# Altium project Diploma.PrjPcb
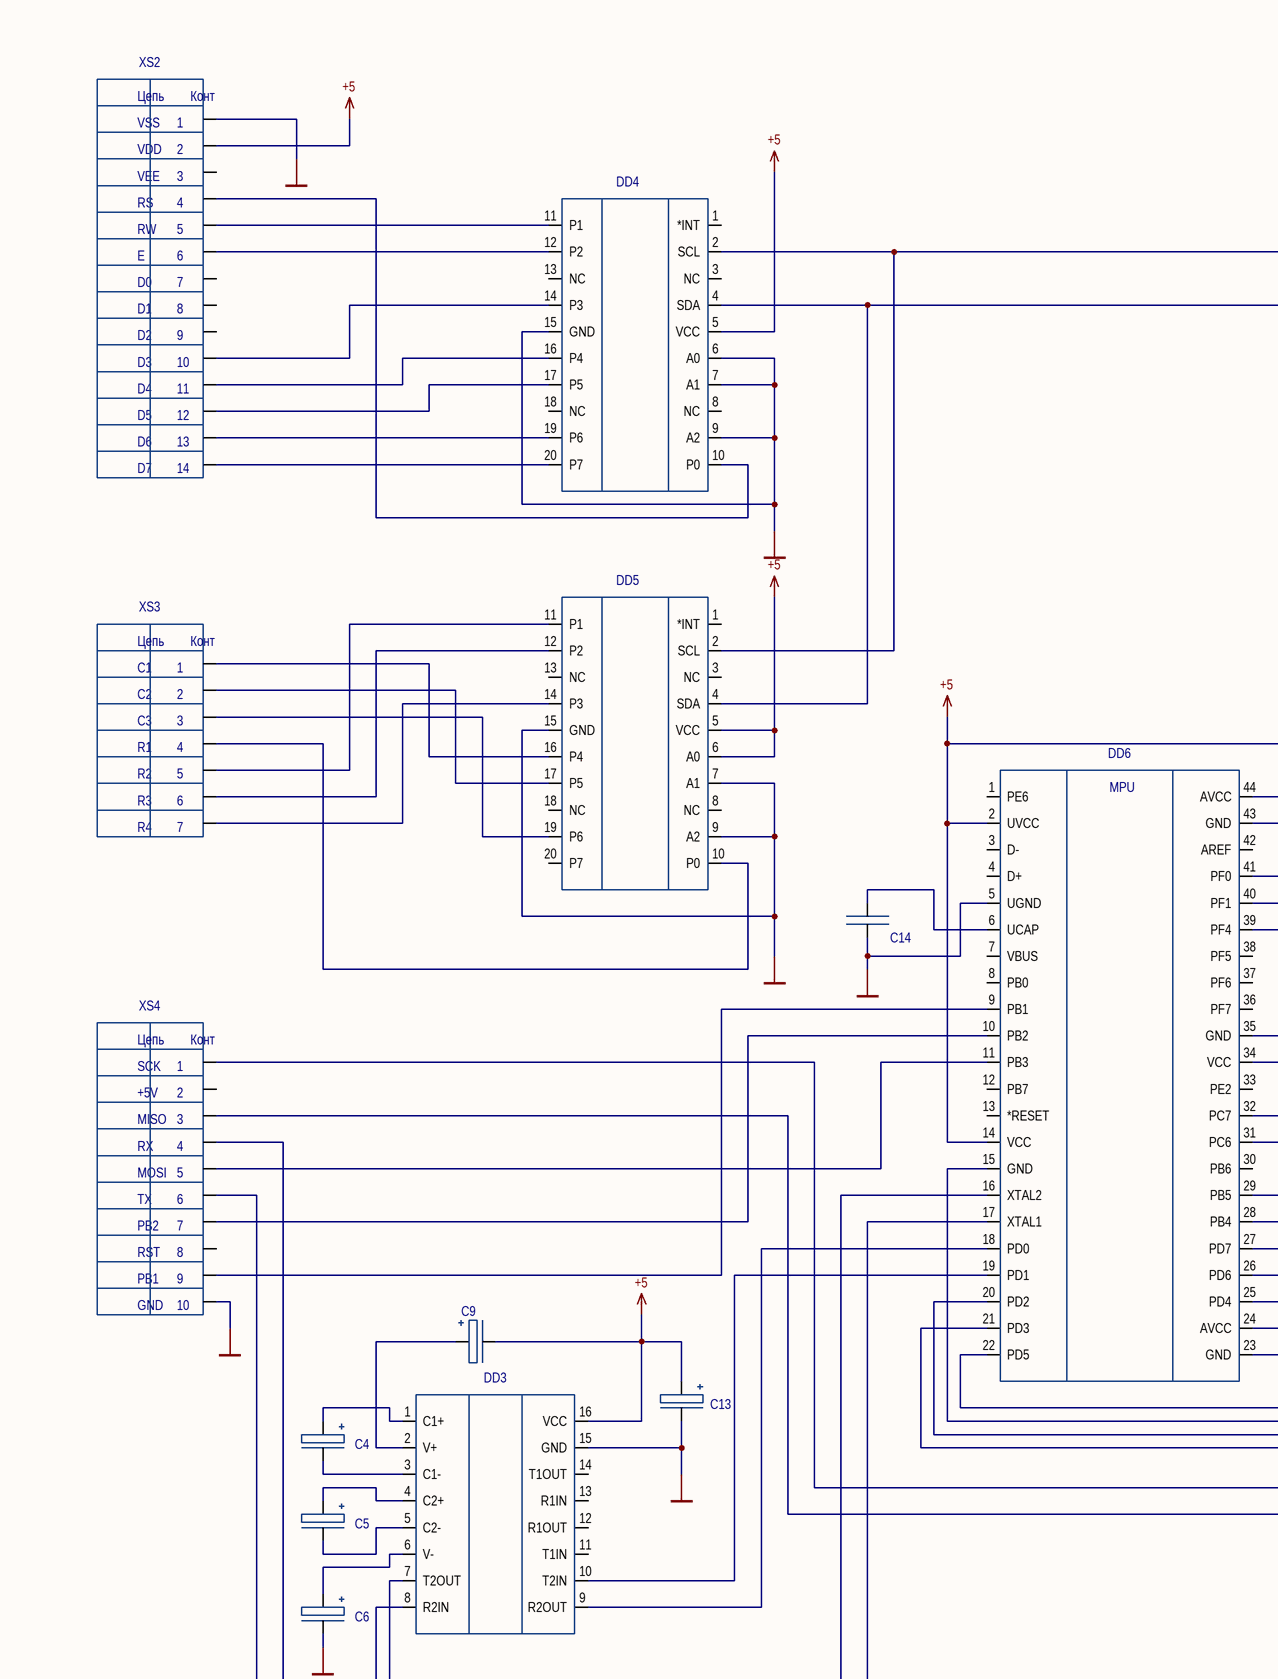
[diagram p0: main.SchDoc, top left]
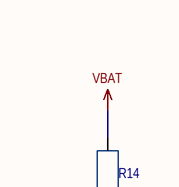
[diagram p1: main.SchDoc, top right]
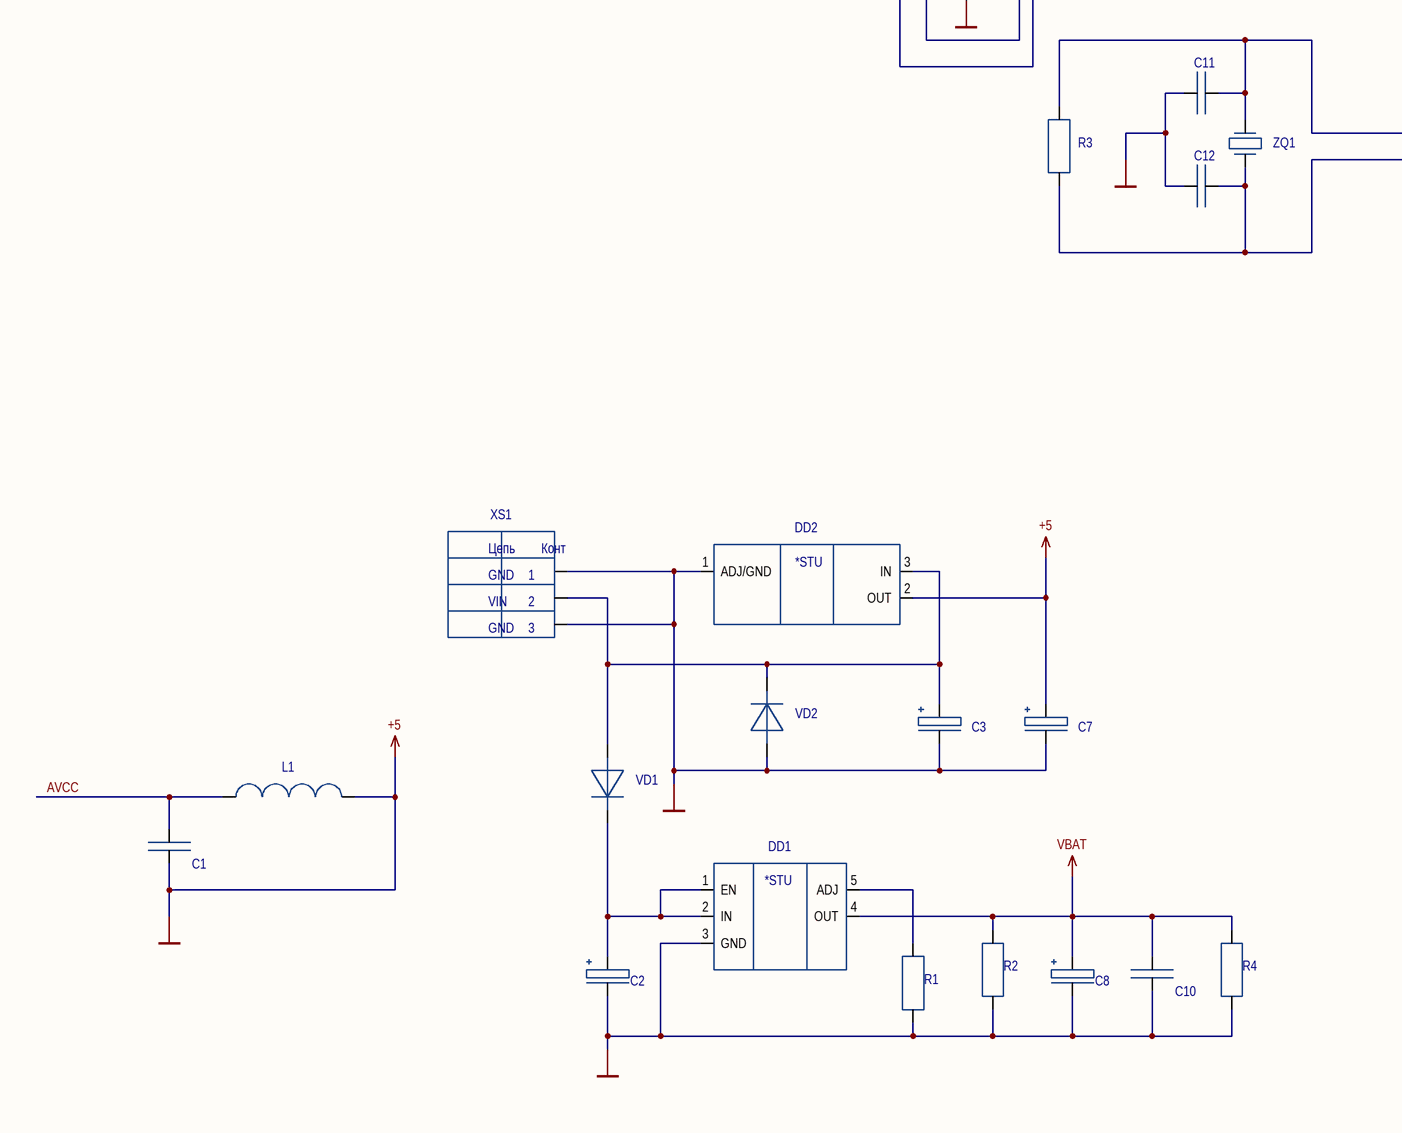
[diagram p2: main.SchDoc, bottom left]
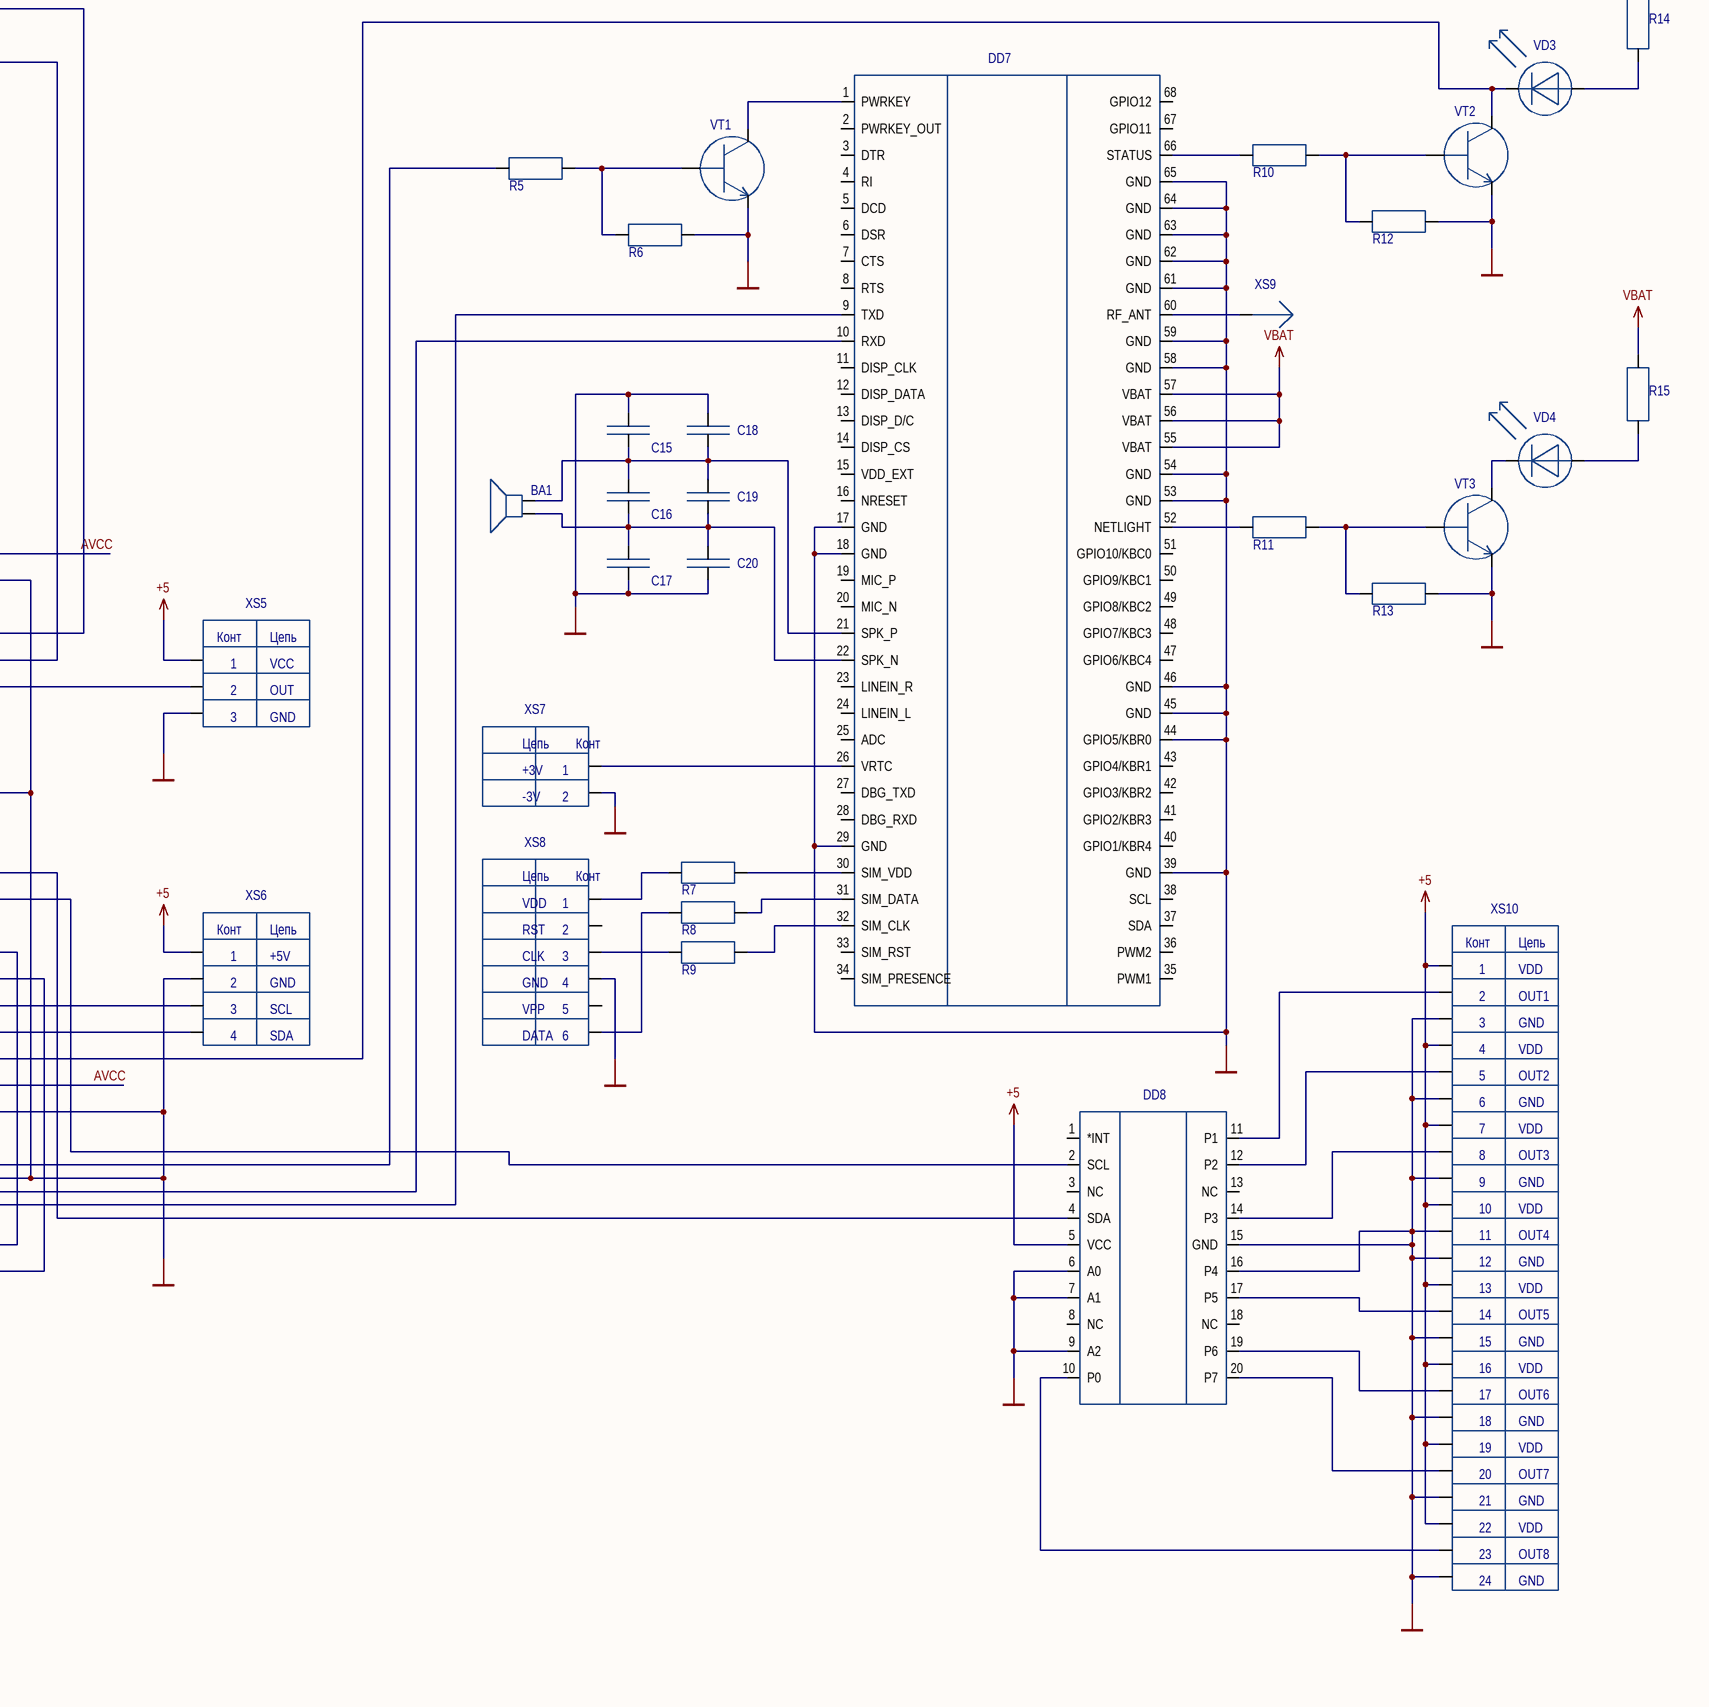
[diagram p3: main.SchDoc, bottom right]
3 sheets, 174 parts. Net scope: global (net labels, ports and power ports of the same name join across sheets).
Sheets:
  main.SchDoc
  struct.SchDoc
  SHEMPEL.SchDoc

## Sheet main.SchDoc
size 840 x 594 mm; CheckedBy: Смирнова; Author: Соколов; DrawnBy: Соколов; Organization: БГУИР, 750701; DocumentNumber: ГУИР.123456.001 Э3; SheetNumber: 1; SheetTotal: 1; Title1str: Дистанционная система; Title2str: управления климатом дома

### Parts
BA1  beeper_HPA17F  (value not drawn)
C1  cap_1mkF  (value not drawn)
C2  cap_pol_100mkF  (value not drawn)
C3  pol_10mkF  (value not drawn)
C4  pol_1mkF  (value not drawn)
C5  pol_1mkF  (value not drawn)
C6  pol_1mkF  (value not drawn)
C7  pol_10mkF  (value not drawn)
C8  cap_pol_100mkF  (value not drawn)
C9  pol_1mkF  (value not drawn)
C10  cap_100nF  (value not drawn)
C11  33pF  (value not drawn)
C12  33pF  (value not drawn)
C13  pol_1mkF  (value not drawn)
C14  cap_1mkF  (value not drawn)
C15  cap_10pF  (value not drawn)
C16  cap_10pF  (value not drawn)
C17  cap_10pF  (value not drawn)
C18  cap_33pF  (value not drawn)
C19  cap_33pF  (value not drawn)
C20  cap_33pF  (value not drawn)
DD1  stu_MIC29302WT  (value not drawn)
DD2  NCP1117ST50T3G  [SOT223-3_ONS]  (value not drawn)
DD3  MAX232CSE+  [21-0041_S16+3_MXM]  (value not drawn)
DD4  PCF8574DGVR  [DGV20]  (value not drawn)
DD5  PCF8574DGVR  [DGV20]  (value not drawn)
DD6  ATMEGA32U4RC-AU  [44ML_ATM]  (value not drawn)
DD7  SIM900A  (value not drawn)
DD8  PCF8574DGVR  [DGV20]  (value not drawn)
L1  inductor_10uH  (value not drawn)
R1  res_47k  (value not drawn)
R2  res_100K  (value not drawn)
R3  res_1M  (value not drawn)
R4  res_510  (value not drawn)
R5  res_4.7k  (value not drawn)
R6  res_47k  (value not drawn)
R7  res_22  (value not drawn)
R8  res_22  (value not drawn)
R9  res_22  (value not drawn)
R10  res_4.7k  (value not drawn)
R11  res_4.7k  (value not drawn)
R12  res_47k  (value not drawn)
R13  res_47k  (value not drawn)
R14  res_510  (value not drawn)
R15  res_510  (value not drawn)
VD1  diode_M7  (value not drawn)
VD2  diode_M7  (value not drawn)
VD3  diode_red  (value not drawn)
VD4  diode_red  (value not drawn)
VT1  BC547  (value not drawn)
VT2  BC547  (value not drawn)
VT3  BC547  (value not drawn)
XS1  power_supply_jack  (value not drawn)
XS2  LCD_connector  (value not drawn)
XS3  conn_Keypad  (value not drawn)
XS4  BH-10  (value not drawn)
XS5  VS1833B  (value not drawn)
XS6  usb_typeA  (value not drawn)
XS7  conn_Battery_CR2032  (value not drawn)
XS8  SIM5051-6-0-18-00-A  [SIM5051-6-0-18-00-A_GCT]  (value not drawn)
XS9  antenn_connector  (value not drawn)
XS10  ds1013  (value not drawn)
ZQ1  crystal_8mhz  (value not drawn)

### Nets
+5: C1.1 C2.1 C3.1 C6.1 C7.1 C7.2 C8.1 C9.1 C10.1 C11.2 C12.2 C13.1 C13.2 C15.2 C17.1 C18.2 C20.1 DD1.3(GND) DD2.1(ADJ/GND) DD2.2(OUT) DD3.15(GND) DD3.16(VCC) DD4.5(VCC) DD4.6(A0) DD4.7(A1) DD4.9(A2) DD4.15(GND) DD5.5(VCC) DD5.6(A0) DD5.7(A1) DD5.9(A2) DD5.15(GND) DD6.2(UVCC) DD6.14(VCC) DD6.15(GND) DD6.23(GND) DD6.34(VCC) DD6.35(GND) DD6.43(GND) DD7.17(GND) DD7.18(GND) DD7.29(GND) DD7.39(GND) DD7.44(GPIO5/KBR0) DD7.45(GND) DD7.46(GND) DD7.53(GND) DD7.54(GND) DD7.58(GND) DD7.59(GND) DD7.61(GND) DD7.62(GND) DD7.63(GND) DD7.64(GND) DD7.65(GND) DD8.5(VCC) DD8.6(A0) DD8.7(A1) DD8.9(A2) DD8.15(GND) DD8.16(P4) L1.2 R1.1 R2.1 R4.1 R6.2 R12.2 R13.2 VD2.1 VT1.1(E) VT2.1(E) VT3.1(E) XS1.1(+5V) XS1.3(SCL) XS2.1(VSS) XS2.2(VDD) XS4.10(D3) XS5.1(VCC) XS5.3(GND) XS6.1(+5V) XS6.2(GND) XS7.2 XS8.4(GND) XS10.1(VSS) XS10.3(VO) XS10.4(C/D) XS10.6(*WR) XS10.7(D0) XS10.9(D2) XS10.10(D3) XS10.11(D4) XS10.12(D5) XS10.13(D6) XS10.15 XS10.16 XS10.18 XS10.19 XS10.21 XS10.22 XS10.24  [also labelled GND]  [project net Y]
UGND: C14.1 DD6.5(UGND)
VBAT: C8.2 C10.2 DD1.4(OUT) DD7.55(VBAT) DD7.56(VBAT) DD7.57(VBAT) R2.2 R4.2 R14.2 R15.2
AVCC: C1.2 DD6.24(AVCC) DD6.44(AVCC) L1.1
NetBA1_1: BA1.1 C15.1 C16.2 C18.1 C19.2 DD7.21(SPK_P)
NetBA1_2: BA1.2 C16.1 C17.2 C19.1 C20.2 DD7.22(SPK_N)
NetC2_2: C2.2 DD1.1(EN) DD1.2(IN) VD1.2
NetC3_2: C3.2 DD2.3(IN) VD1.1 VD2.2 XS1.2(GND)
NetC4_1: C4.1 DD3.3(C1-)
NetC4_2: C4.2 DD3.1(C1+)
NetC5_1: C5.1 DD3.5(C2-)
NetC5_2: C5.2 DD3.4(C2+)
NetC6_2: C6.2 DD3.6(V-)
NetC9_2: C9.2 DD3.2(V+)
NetC11_1: C11.1 DD6.16(XTAL2) R3.2 ZQ1.2
NetC12_1: C12.1 DD6.17(XTAL1) R3.1 ZQ1.1
NetC14_2: C14.2 DD6.6(UCAP)
NetDD1_5: DD1.5(ADJ) R1.2
NetDD3_7: DD3.7(T2OUT) XS4.6(*WR)
NetDD3_8: DD3.8(R2IN) XS4.4(C/D)
NetDD3_9: DD3.9(R2OUT) DD6.18(PD0)
NetDD3_10: DD3.10(T2IN) DD6.19(PD1)
NetDD4_2: DD4.2(SCL) DD5.2(SCL) DD6.41(PF0)
NetDD4_4: DD4.4(SDA) DD5.4(SDA) DD6.40(PF1)
NetDD4_10: DD4.10(P0) XS2.4(C/D)
NetDD4_11: DD4.11(P1) XS2.5(*RD)
NetDD4_12: DD4.12(P2) XS2.6(*WR)
NetDD4_14: DD4.14(P3) XS2.10(D3)
NetDD4_16: DD4.16(P4) XS2.11(D4)
NetDD4_17: DD4.17(P5) XS2.12(D5)
NetDD4_19: DD4.19(P6) XS2.13(D6)
NetDD4_20: DD4.20(P7) XS2.14(D7)
NetDD5_10: DD5.10(P0) XS3.4(C/D)
NetDD5_11: DD5.11(P1) XS3.5(*RD)
NetDD5_12: DD5.12(P2) XS3.6(*WR)
NetDD5_14: DD5.14(P3) XS3.7(D0)
NetDD5_16: DD5.16(P4) XS3.1(VSS)
NetDD5_17: DD5.17(P5) XS3.2(VDD)
NetDD5_19: DD5.19(P6) XS3.3(VO)
NetDD6_9: DD6.9(PB1) XS4.9(D2)
NetDD6_10: DD6.10(PB2) XS4.7(D0)
NetDD6_11: DD6.11(PB3) XS4.5(*RD)
NetDD6_20: DD6.20(PD2) DD7.10(RXD)
NetDD6_21: DD6.21(PD3) DD7.9(TXD)
NetDD6_22: DD6.22(PD5) R5.1
NetDD6_25: DD6.25(PD4) VD3.2 VT2.3(C)
NetDD6_26: DD6.26(PD6) XS6.4(SDA)
NetDD6_27: DD6.27(PD7) XS6.3(SCL)
NetDD6_28: DD6.28(PB4) XS4.3(VO)
NetDD6_29: DD6.29(PB5) XS4.1(VSS)
NetDD6_31: DD6.31(PC6) DD8.2(SCL)
NetDD6_32: DD6.32(PC7) DD8.4(SDA)
NetDD6_39: DD6.39(PF4) XS5.2(OUT)
NetDD7_1: DD7.1(PWRKEY) VT1.3(C)
NetDD7_26: DD7.26(VRTC) XS7.1(VCC)
NetDD7_30: DD7.30(SIM_VDD) R7.2
NetDD7_31: DD7.31(SIM_DATA) R8.2
NetDD7_32: DD7.32(SIM_CLK) R9.2
NetDD7_52: DD7.52(NETLIGHT) R11.1
NetDD7_60: DD7.60(RF_ANT) XS9.1
NetDD7_66: DD7.66(STATUS) R10.1
NetDD8_10: DD8.10(P0) XS10.23
NetDD8_11: DD8.11(P1) XS10.2(VDD)
NetDD8_12: DD8.12(P2) XS10.5(*RD)
NetDD8_14: DD8.14(P3) XS10.8(D1)
NetDD8_17: DD8.17(P5) XS10.14(D7)
NetDD8_19: DD8.19(P6) XS10.17
NetDD8_20: DD8.20(P7) XS10.20
NetR5_2: R5.2 R6.1 VT1.2(B)
NetR7_1: R7.1 XS8.1(VCC)
NetR8_1: R8.1 XS8.6(I/O)
NetR9_1: R9.1 XS8.3(CLK)
NetR10_2: R10.2 R12.1 VT2.2(B)
NetR11_2: R11.2 R13.1 VT3.2(B)
NetR14_1: R14.1 VD3.1
NetR15_1: R15.1 VD4.1
NetVD4_2: VD4.2 VT3.3(C)

Not connected (* = marked no-connect by the designer): DD3 11(T1IN) 12(R1OUT) 13(R1IN) 14(T1OUT); DD4 1(*INT) 3(NC) 8(NC) 13(NC) 18(NC); DD5 1(*INT) 3(NC) 8(NC) 13(NC) 18(NC) 20(P7); DD6 1(PE6) 3(D-) 4(D+) 7(VBUS) 8(PB0) 12(PB7) 13(*RESET) 30(PB6) 33(PE2) 36(PF7) 37(PF6) 38(PF5) 42(AREF); DD7 2(PWRKEY_OUT) 3(DTR) 4(RI) 5(DCD) 6(DSR) 7(CTS) 8(RTS) 11(DISP_CLK) 12(DISP_DATA) 13(DISP_D/C) 14(DISP_CS) 15(VDD_EXT) 16(NRESET) 19(MIC_P) 20(MIC_N) 23(LINEIN_R) 24(LINEIN_L) 25(ADC) 27(DBG_TXD) 28(DBG_RXD) 33(SIM_RST) 34(SIM_PRESENCE) 35(PWM1) 36(PWM2) 37(SDA) 38(SCL) 40(GPIO1/KBR4) 41(GPIO2/KBR3) 42(GPIO3/KBR2) 43(GPIO4/KBR1) 47(GPIO6/KBC4) 48(GPIO7/KBC3) 49(GPIO8/KBC2) 50(GPIO9/KBC1) 51(GPIO10/KBC0) 67(GPIO11) 68(GPIO12); DD8 1(*INT) 3(NC) 8(NC) 13(NC) 18(NC); XS2 3(VO) 7(D0) 8(D1) 9(D2); XS4 2(VDD) 8(D1); XS8 2(RST) 5(VPP)

### Notes on the sheet
- Перв. примен.
- Справ. №
- Н.контр.
- Подп. и дата
- Инв. № дубл.
- Разраб.
- Взам. инв. №
- Изм.
- Лист
- № докум.
- Подп.
- Дата
- Лит.
- Масса
- Масштаб
- Пров.
- Т.контр.
- Листов
- Инв. № подл.
- Утв.
- Согласов.
- Копировал
- Формат  A1М
- (in symbol ATMEGA32U4RC-AU) MPU
- (in symbol conn_Battery_CR2032) Цепь; Конт; +3V; -3V
- (in symbol conn_Keypad) Цепь; Конт; C1; C2; C3; R1; R2; R3; R4
- (in symbol LCD_connector) Цепь; Конт; VEE; RS; RW; E
- (in symbol NCP1117ST50T3G) *STU
- (in symbol power_supply_jack) Цепь; Конт; VIN
- (in symbol RS-232) Цепь; Конт; SCK; +5V; MISO; RX; MOSI; TX; PB2; RST; PB1; GND
- (in symbol SIM5051-6-0-18-00-A) Цепь; Конт; VDD; DATA
- (in symbol stu_MIC29302WT) *STU
- (in symbol temperature_sensors_connector) Конт; Цепь; OUT1; GND; OUT2; OUT3; OUT4; OUT5; OUT6; OUT7; OUT8
- (in symbol usb_typeA) Конт; Цепь
- (in symbol VS1833B) Конт; Цепь

### Library data of the parts
C3 C7 = cap_pol_10mkF
C4-C6 C9 C13 = cap_pol_1mkF
C11 C12 = cap_33pF
DD2 = NCP1117ST50T3G: No Description Available; Vendor: ON Semiconductor; SourceLibrary: ONSemi_2017-12-12_4; Manufacturer_Part_Number: NCP1117ST50T3G; Copyright: Copyright (C) 2016 Accelerated Designs. All rights reserved; RefDes: RefDes; Type: DEV
DD3 = MAX232CSE+: No Description Available; SourceLibrary: Update_to_database_2021-01-29; Built_By: EMA_UL_Team; Vendor: Maxim Integrated Products; Revision: 4; Manufacturer_Part_Number: MAX232CSE+; Copyright: Copyright (C) 2018 Accelerated Designs. All rights reserved; RefDes: RefDes; Type: DEV
DD4 DD5 DD8 = PCF8574DGVR: Remote 8-Bit I/O Expander for I2C-Bus; Manufacturer: Texas Instruments; INDUSTRY_STD_PKG_TYPE: TVSOP; FAMILY_NAME: I2C IO EXPANDER; PIN_COUNT: 20; PACKAGE_DESIGNATOR: DGV; Datasheet_URL: http://www.ti.com/lit/gpn/PCF8574; GENERIC_PART_NUMBER: PCF8574; Vendor: Texas Instruments; Manufacturer_Part_Number: PCF8574DGVR; Copyright: Copyright (C) 2018 Accelerated Designs. All rights reserved; RefDes: RefDes; Type: DEV
DD6 = ATMEGA32U4RC-AU: No Description Available; Vendor: Atmel; Built_By: EMA_UL_Team; SourceLibrary: Atmel_2015-02-13; Manufacturer_Part_Number: ATMEGA32U4RC-AU; Copyright: Copyright (C) 2018 Accelerated Designs. All rights reserved; RefDes: RefDes; Type: DEV
XS4 = RS-232
XS8 = SIM5051-6-0-18-00-A: No Description Available; Vendor: Global Connector Technology; Built_By: EMA_Cory; SourceLibrary: GCT_2020-07-23; Datasheet: https://gct.co/files/drawings/sim5051.pdf; Manufacturer_Part_Number: SIM5051-6-0-18-00-A; Copyright: Copyright (C) 2018 Accelerated Designs. All rights reserved; RefDes: RefDes; Type: DEV
XS10 = temperature_sensors_connector

## Sheet struct.SchDoc
size 594 x 420 mm; CompanyName: БГУИР, 750701; SheetNumber: 2; SheetTotal: 2; Разраб.: Шемпель; Пров.: Смирнова
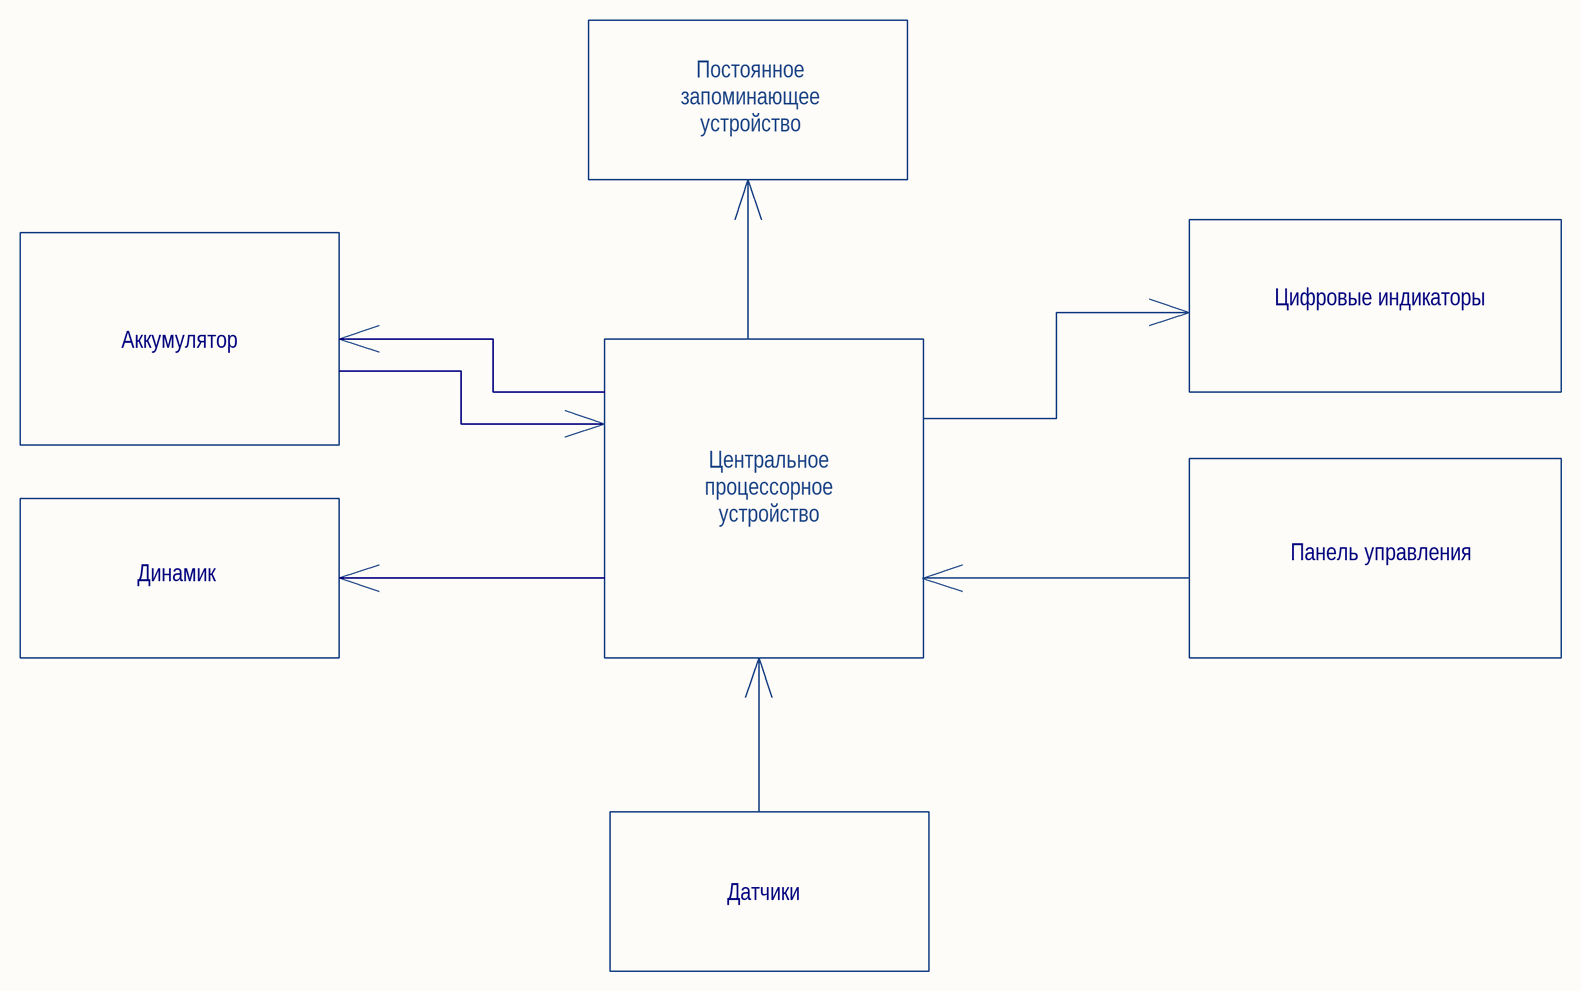
[diagram p4: struct.SchDoc]

### Notes on the sheet
- Постоянное запоминающее устройство
- Аккумулятор
- Цифровые индикаторы
- Центральное процессорное устройство
- Панель управления
- Динамик
- Датчики
- Перв. примен.
- Справ. №
- Подп. и дата
- Инв. № дубл.
- Взам. инв. №
- Разраб.
- Изм.
- Лист
- № докум.
- Подп.
- Дата
- Лит.
- Масса
- Масштаб
- Пров.
- Т.контр.
- Листов
- Инв. № подл.
- Утв.
- Н.контр.
- Копировал
- Формат А2

## Sheet SHEMPEL.SchDoc
size 840 x 594 mm; ListNumber: 1
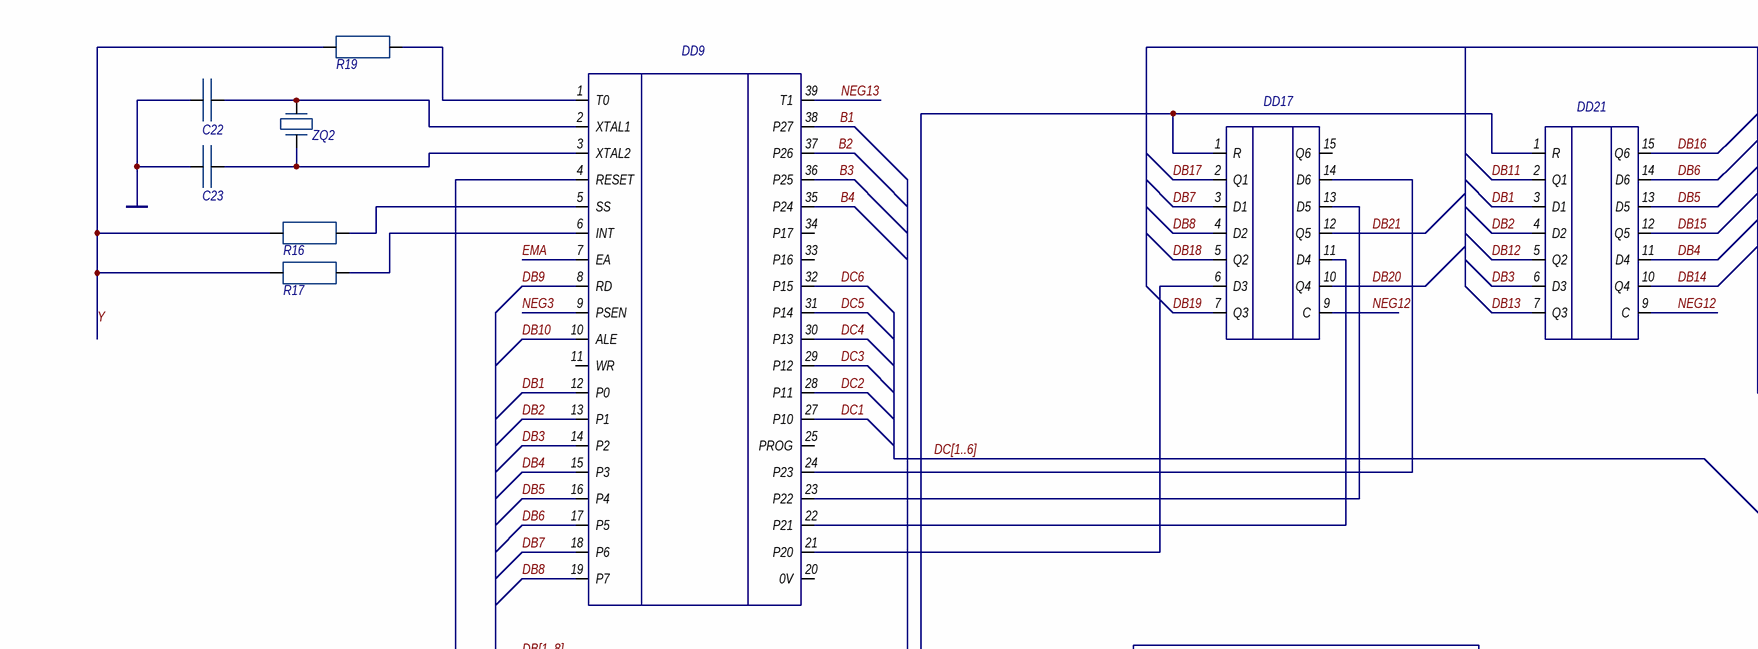
[diagram p5: SHEMPEL.SchDoc, top left]
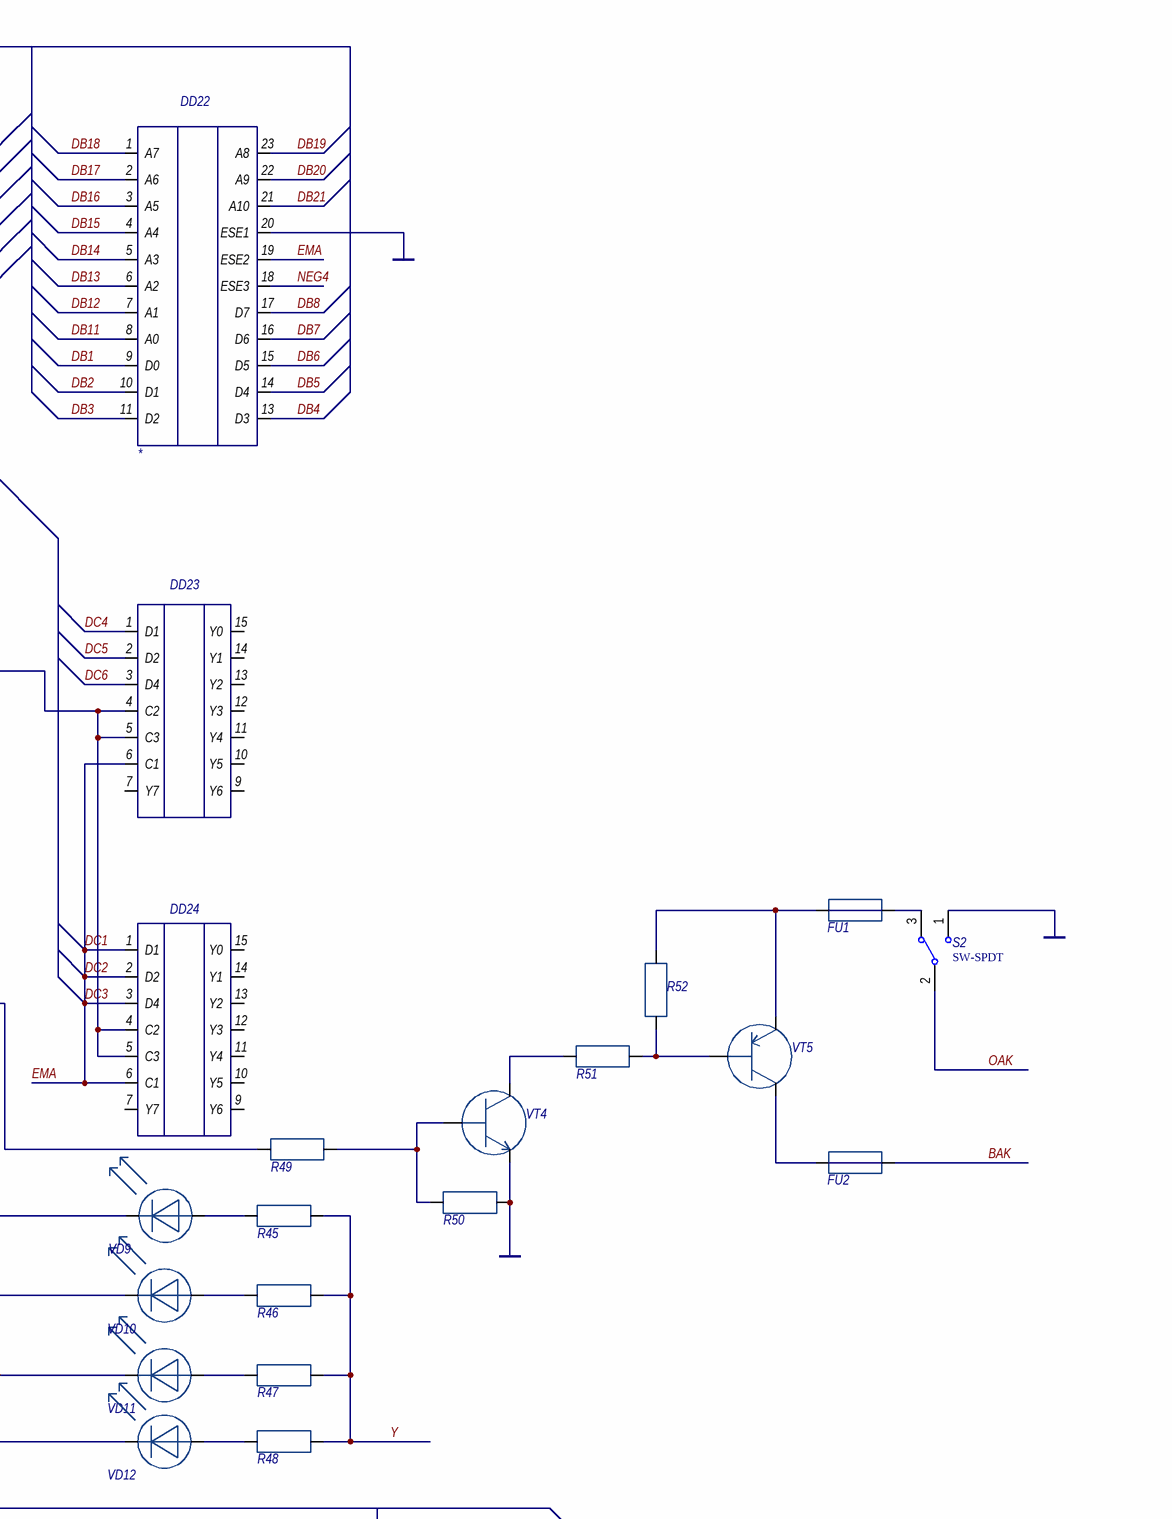
[diagram p6: SHEMPEL.SchDoc, top right]
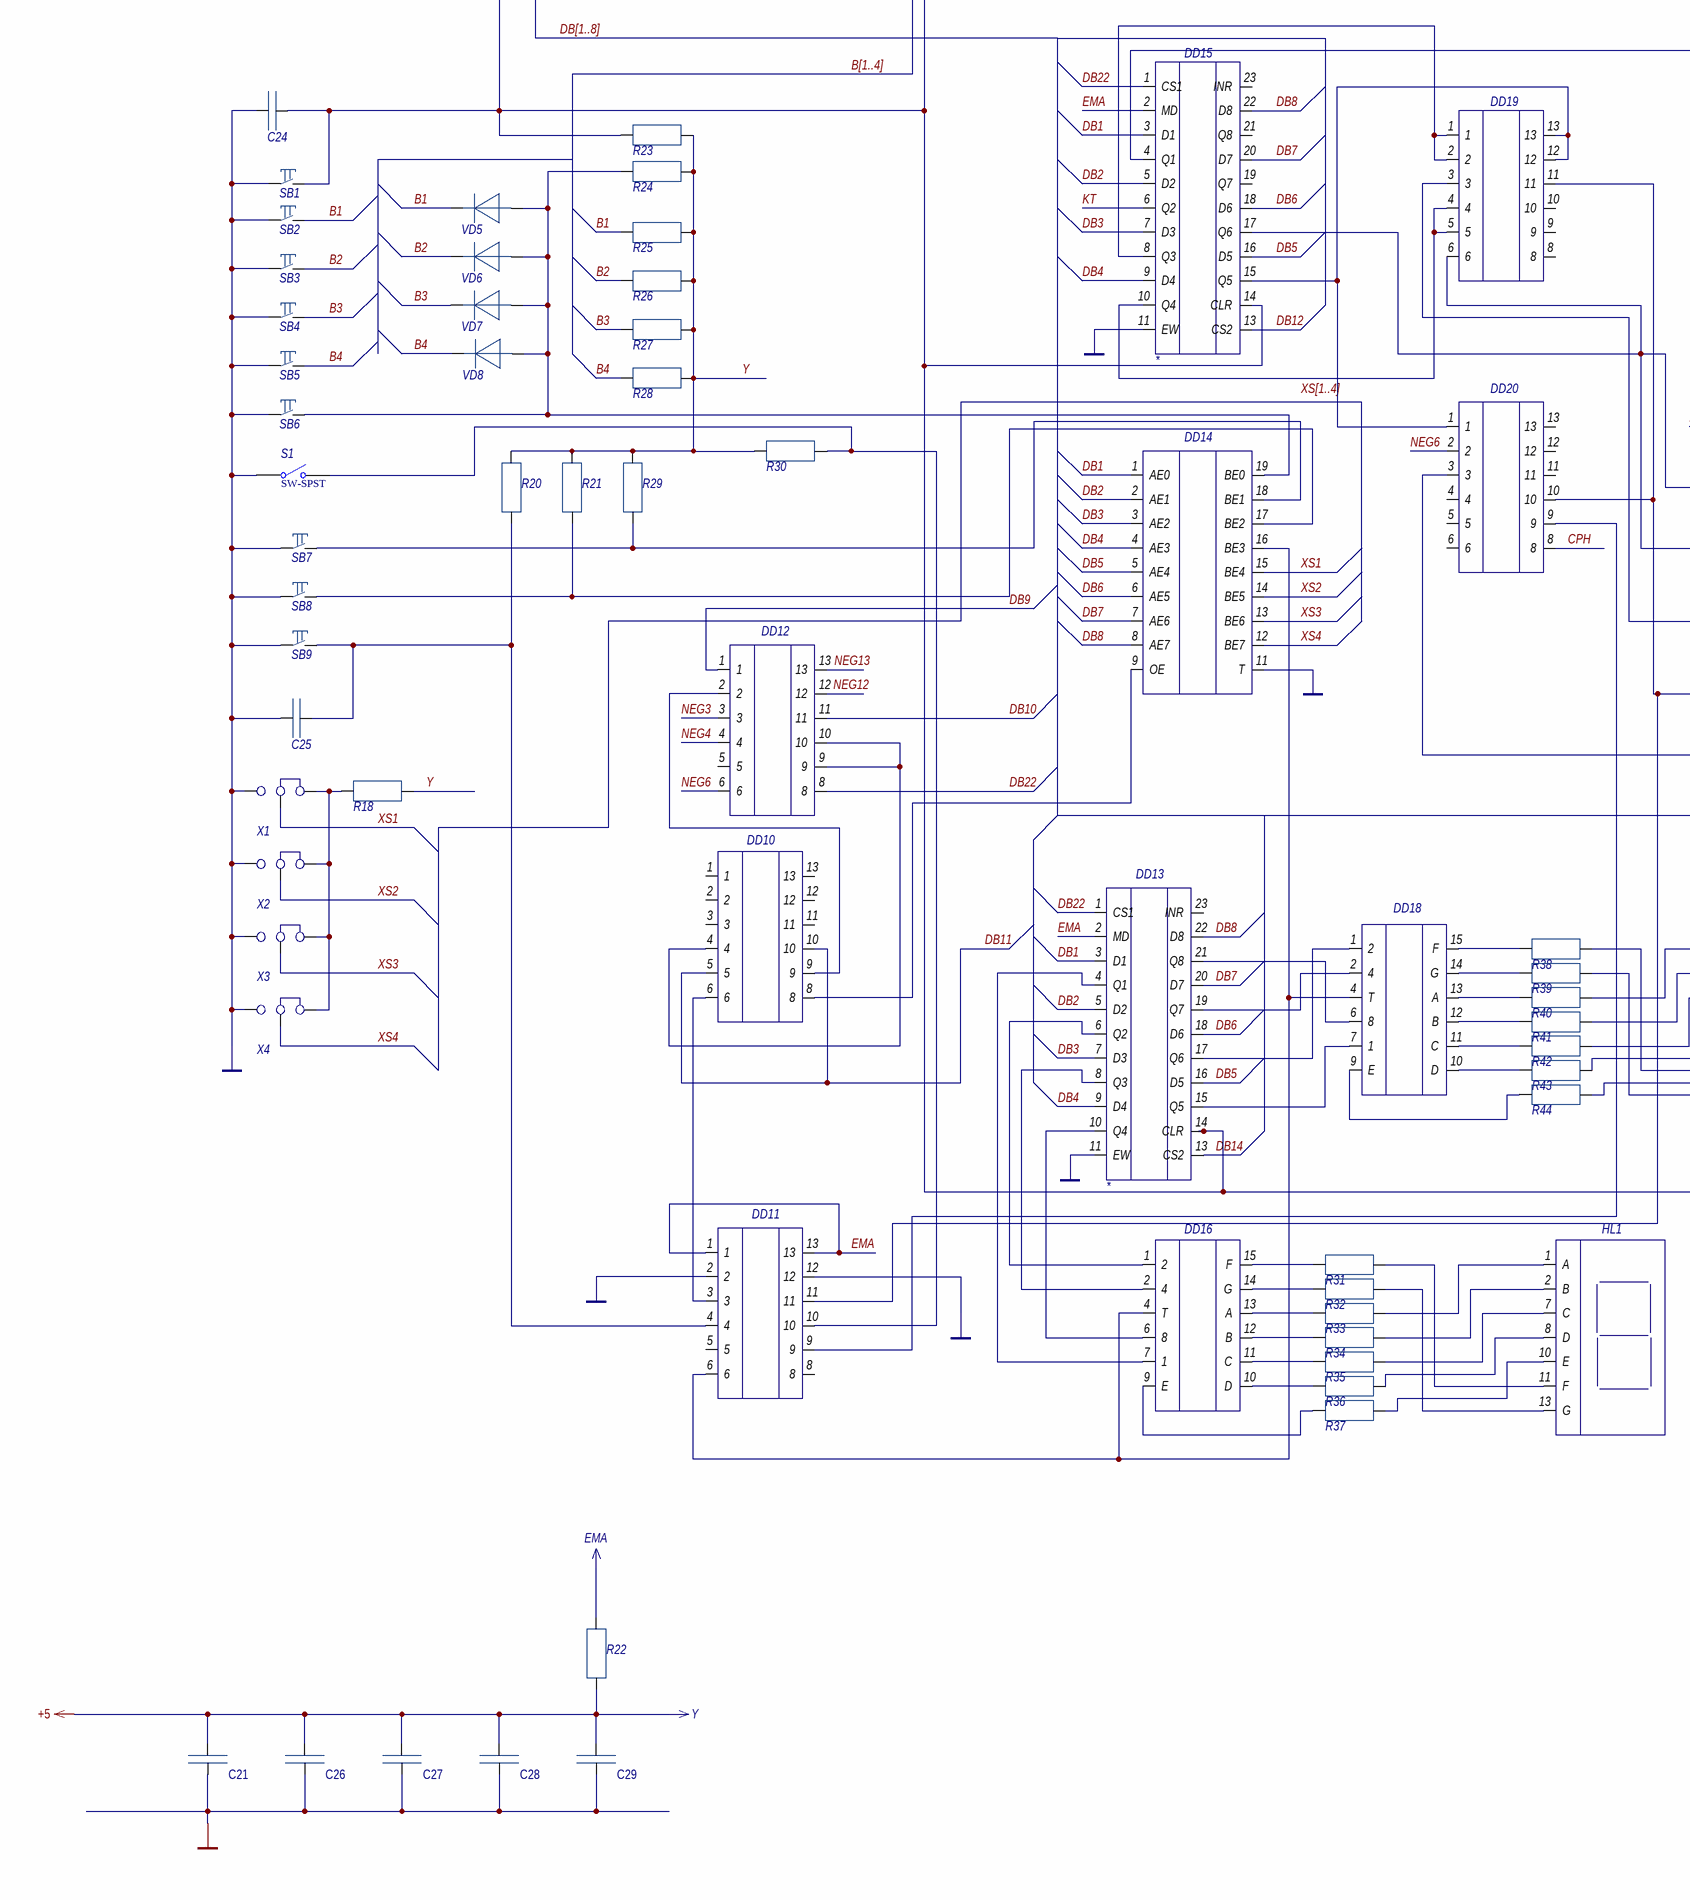
[diagram p7: SHEMPEL.SchDoc, bottom left]
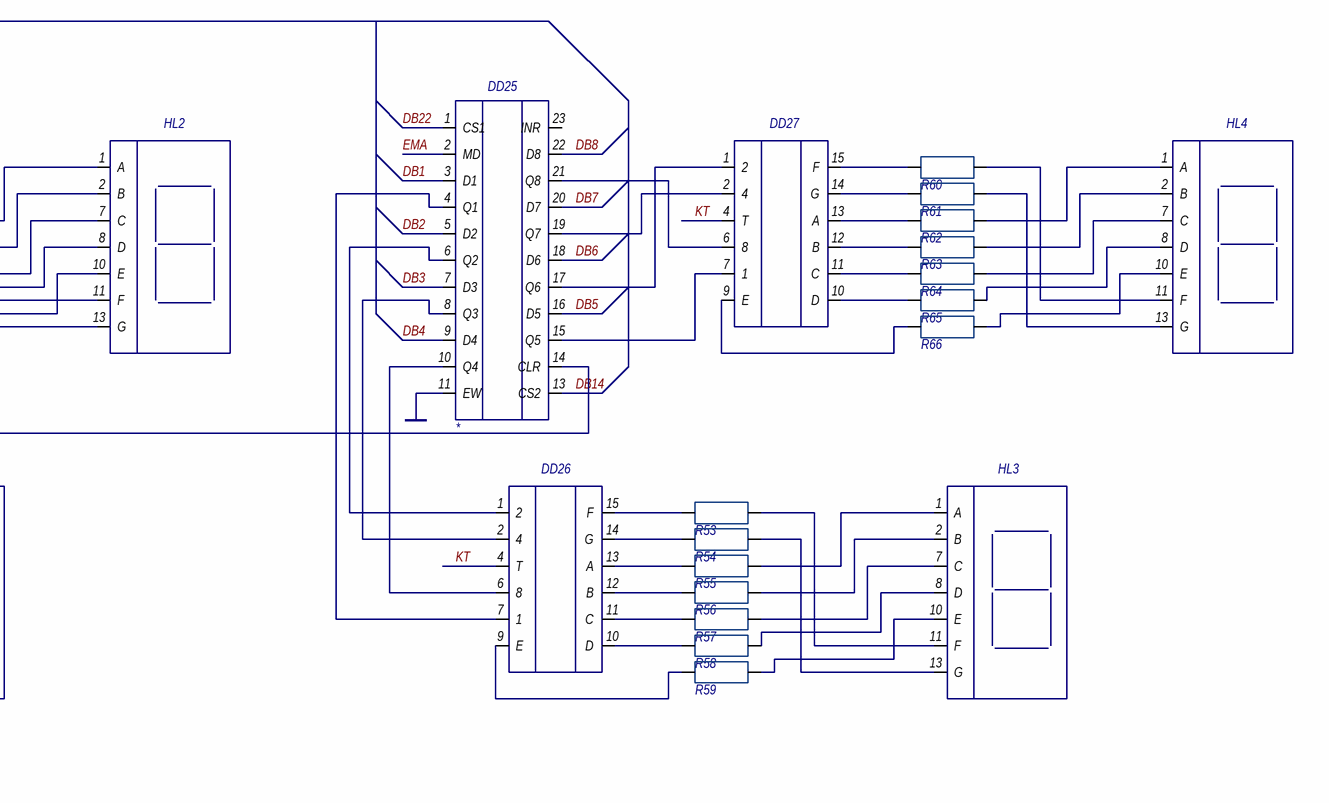
[diagram p8: SHEMPEL.SchDoc, bottom right]

### Parts
C21  cap_1mkF  (value not drawn)
C22  33pF  (value not drawn)
C23  33pF  (value not drawn)
C24  33pF  (value not drawn)
C25  33pF  (value not drawn)
C26  cap_1mkF  (value not drawn)
C27  cap_1mkF  (value not drawn)
C28  cap_1mkF  (value not drawn)
C29  cap_1mkF  (value not drawn)
DD9  *  (value not drawn)
DD10  K533LA3  (value not drawn)
DD11  KR1533TM2  (value not drawn)
DD12  K533LN1  (value not drawn)
DD13  *
DD14  *  (value not drawn)
DD15  *
DD16  K514ID2  (value not drawn)
DD17  *  (value not drawn)
DD18  K514ID2  (value not drawn)
DD19  KR1533LA9  (value not drawn)
DD20  KR1533LA9  (value not drawn)
DD21  *  (value not drawn)
DD22  *
DD23  *  (value not drawn)
DD24  *  (value not drawn)
DD25  *
DD26  K514ID2  (value not drawn)
DD27  K514ID2  (value not drawn)
FU1  fu  (value not drawn)
FU2  fu  (value not drawn)
HL1  semisigment  (value not drawn)
HL2  semisigment  (value not drawn)
HL3  semisigment  (value not drawn)
HL4  semisigment  (value not drawn)
R16  *  (value not drawn)
R17  *  (value not drawn)
R18  *  (value not drawn)
R19  *  (value not drawn)
R20  *  (value not drawn)
R21  *  (value not drawn)
R22  *  (value not drawn)
R23  *  (value not drawn)
R24  *  (value not drawn)
R25  *  (value not drawn)
R26  *  (value not drawn)
R27  *  (value not drawn)
R28  *  (value not drawn)
R29  *  (value not drawn)
R30  *  (value not drawn)
R31  *  (value not drawn)
R32  *  (value not drawn)
R33  *  (value not drawn)
R34  *  (value not drawn)
R35  *  (value not drawn)
R36  *  (value not drawn)
R37  *  (value not drawn)
R38  *  (value not drawn)
R39  *  (value not drawn)
R40  *  (value not drawn)
R41  *  (value not drawn)
R42  *  (value not drawn)
R43  *  (value not drawn)
R44  *  (value not drawn)
R45  *  (value not drawn)
R46  *  (value not drawn)
R47  *  (value not drawn)
R48  *  (value not drawn)
R49  *  (value not drawn)
R50  *  (value not drawn)
R51  *  (value not drawn)
R52  *  (value not drawn)
R53  *  (value not drawn)
R54  *  (value not drawn)
R55  *  (value not drawn)
R56  *  (value not drawn)
R57  *  (value not drawn)
R58  *  (value not drawn)
R59  *  (value not drawn)
R60  *  (value not drawn)
R61  *  (value not drawn)
R62  *  (value not drawn)
R63  *  (value not drawn)
R64  *  (value not drawn)
R65  *  (value not drawn)
R66  *  (value not drawn)
S1  SW-SPST  [SPST-2]
S2  SW-SPDT  [TL36WW15050]
SB1  button_keypad  (value not drawn)
SB2  button_keypad  (value not drawn)
SB3  button_keypad  (value not drawn)
SB4  button_keypad  (value not drawn)
SB5  button_keypad  (value not drawn)
SB6  button_keypad  (value not drawn)
SB7  button_keypad  (value not drawn)
SB8  button_keypad  (value not drawn)
SB9  button_keypad  (value not drawn)
VD5  M7  (value not drawn)
VD6  M7  (value not drawn)
VD7  M7  (value not drawn)
VD8  M7  (value not drawn)
VD9  red_GNL-3012HD  (value not drawn)
VD10  red_GNL-3012HD  (value not drawn)
VD11  red_GNL-3012HD  (value not drawn)
VD12  red_GNL-3012HD  (value not drawn)
VT4  BC547  (value not drawn)
VT5  trans  (value not drawn)
X1  switcher  (value not drawn)
X2  switcher  (value not drawn)
X3  switcher  (value not drawn)
X4  switcher  (value not drawn)
ZQ2  HC-49S  (value not drawn)

### Nets
DC1: DD9.7(EA) DD9.27(P10) DD9.28(P11) DD9.29(P12) DD11.1 DD11.13 DD13.2(MD) DD15.2(MD) DD22.19(ESE2) DD23.6(C1) DD24.1(D1) DD24.2(D2) DD24.3(D4) DD24.6(C1) DD25.2(MD) R22.2  [also labelled DC2, DC3, EMA]
Y: C21.1 C21.2 C22.1 C23.1 C24.1 C25.1 C26.1 C26.2 C27.1 C27.2 C28.1 C28.2 C29.1 C29.2 DD11.2 DD11.12 DD13.11(EW) DD14.11(T) DD15.11(EW) DD22.20(ESE1) DD25.11(EW) R16.1 R17.1 R18.2 R19.1 R20.2 R21.2 R22.1 R23.2 R24.2 R25.2 R26.2 R27.2 R28.2 R29.2 R30.1 R45.2 R46.2 R47.2 R48.2 R50.2 S1.1(COMMON) S2.1 SB1.1 SB2.1 SB3.1 SB4.1 SB5.1 SB6.1 SB7.1 SB8.1 SB9.1 VT4.1(E) X1.1 X2.1 X3.1 X4.1  [also labelled +5, GND]
B1: DD9.38(P27) R25.1 SB2.2 VD5.2
B2: DD9.37(P26) R26.1 SB3.2 VD6.2
B3: DD9.36(P25) R27.1 SB4.2 VD7.2
B4: DD9.35(P24) R28.1 SB5.2 VD8.2
BAK: FU2.2
CPH: DD20.8
DB1: DD9.12(P0) DD13.3(D1) DD14.1(AE0) DD15.3(D1) DD21.3(D1) DD22.9(D0) DD25.3(D1)
DB2: DD9.13(P1) DD13.5(D2) DD14.2(AE1) DD15.5(D2) DD21.4(D2) DD22.10(D1) DD25.5(D2)
DB3: DD9.14(P2) DD13.7(D3) DD14.3(AE2) DD15.7(D3) DD21.6(D3) DD22.11(D2) DD25.7(D3)
DB4: DD9.15(P3) DD13.9(D4) DD14.4(AE3) DD15.9(D4) DD21.11(D4) DD22.13(D3) DD25.9(D4)
DB5: DD9.16(P4) DD13.16(D5) DD14.5(AE4) DD15.16(D5) DD21.13(D5) DD22.14(D4) DD25.16(D5)
DB6: DD9.17(P5) DD13.18(D6) DD14.6(AE5) DD15.18(D6) DD21.14(D6) DD22.15(D5) DD25.18(D6)
DB7: DD9.18(P6) DD13.20(D7) DD14.7(AE6) DD15.20(D7) DD17.3(D1) DD22.16(D6) DD25.20(D7)
DB8: DD9.19(P7) DD13.22(D8) DD14.8(AE7) DD15.22(D8) DD17.4(D2) DD22.17(D7) DD25.22(D8)
DB9: DD9.8(RD) DD12.1
DB10: DD9.10(ALE) DD12.11
DB11: DD10.5 DD10.10 DD21.2(Q1) DD22.8(A0)
DB12: DD15.13(CS2) DD21.5(Q2) DD22.7(A1)
DB13: DD21.7(Q3) DD22.6(A2)
DB14: DD13.13(CS2) DD21.10(Q4) DD22.5(A3) DD25.13(CS2)
DB15: DD21.12(Q5) DD22.4(A4)
DB16: DD21.15(Q6) DD22.3(A5)
DB17: DD17.2(Q1) DD22.2(A6)
DB18: DD17.5(Q2) DD22.1(A7)
DB19: DD17.7(Q3) DD22.23(A8)
DB20: DD17.10(Q4) DD22.22(A9)
DB21: DD17.12(Q5) DD22.21(A10)
DB22: DD12.8 DD13.1(CS1) DD15.1(CS1) DD25.1(CS1)
DC4: DD9.30(P13) DD23.1(D1)
DC5: DD9.31(P14) DD23.2(D2)
DC6: DD9.32(P15) DD23.3(D4)
KT: DD15.6(Q2) DD26.4(T) DD27.4(T)
NEG3: DD9.9(PSEN) DD12.3
NEG4: DD12.4 DD22.18(ESE3)
NEG6: DD12.6 DD20.2
NEG12: DD12.12 DD17.9(C) DD21.9(C)
NEG13: DD9.39(T1) DD12.13
OAK: S2.2
XS1: DD14.15(BE4)
XS2: DD14.14(BE5)
XS3: DD14.13(BE6)
XS4: DD14.12(BE7)
NetC22_2: C22.2 DD9.2(XTAL1) ZQ2.2
NetC23_2: C23.2 DD9.3(XTAL2) ZQ2.1
NetC24_2: C24.2 DD9.4(RESET) DD13.14(CLR) DD15.14(CLR) DD17.1(R) DD21.1(R) DD25.14(CLR) R23.1 SB1.2
NetC25_2: C25.2 DD11.4 R20.1 SB9.2
NetDD9_1: DD9.1(T0) R19.2
NetDD9_5: DD9.5(SS) R16.2
NetDD9_6: DD9.6(INT) R17.2
NetDD9_21: DD9.21(P20) DD17.6(D3)
NetDD9_22: DD9.22(P21) DD17.11(D4)
NetDD9_23: DD9.23(P22) DD17.13(D5)
NetDD9_24: DD9.24(P23) DD17.14(D6)
NetDD10_4: DD10.4 DD12.9 DD12.10
NetDD10_6: DD10.6 DD11.3
NetDD10_8: DD10.8 DD14.9(OE)
NetDD10_9: DD10.9 DD12.2
NetDD11_6: DD11.6 DD14.16(BE3) DD16.4(T) DD18.4(T)
NetDD11_9: DD11.9 DD20.9
NetDD11_10: DD11.10 R30.2 S1.2(NO)
NetDD11_11: DD11.11 DD19.11 DD20.10 VD11.2
NetDD13_4: DD13.4(Q1) DD16.7(1)
NetDD13_6: DD13.6(Q2) DD16.1(2)
NetDD13_8: DD13.8(Q3) DD16.2(4)
NetDD13_10: DD13.10(Q4) DD16.6(8)
NetDD13_15: DD13.15(Q5) DD18.7(1)
NetDD13_17: DD13.17(Q6) DD18.1(2)
NetDD13_19: DD13.19(Q7) DD18.2(4)
NetDD13_21: DD13.21(Q8) DD18.6(8)
NetDD14_17: DD14.17(BE2) R21.1 SB8.2
NetDD14_18: DD14.18(BE1) R29.1 SB7.2
NetDD14_19: DD14.19(BE0) R24.1 SB6.2 VD5.1 VD6.1 VD7.1 VD8.1
NetDD15_4: DD15.4(Q1) DD23.4(C2) DD23.5(C3) DD24.4(C2) DD24.5(C3)
NetDD15_8: DD15.8(Q3) DD19.1 DD19.2
NetDD15_10: DD15.10(Q4) DD19.4 DD19.5
NetDD15_15: DD15.15(Q5) DD19.12 DD19.13 DD20.1
NetDD15_17: DD15.17(Q6) DD19.6 R49.1 VD9.2
NetDD16_9: DD16.9(E) R37.1
NetDD16_10: DD16.10(D) R36.1
NetDD16_11: DD16.11(C) R35.1
NetDD16_12: DD16.12(B) R34.1
NetDD16_13: DD16.13(A) R33.1
NetDD16_14: DD16.14(G) R32.1
NetDD16_15: DD16.15(F) R31.1
NetDD18_9: DD18.9(E) R44.1
NetDD18_10: DD18.10(D) R43.1
NetDD18_11: DD18.11(C) R42.1
NetDD18_12: DD18.12(B) R41.1
NetDD18_13: DD18.13(A) R40.1
NetDD18_14: DD18.14(G) R39.1
NetDD18_15: DD18.15(F) R38.1
NetDD19_3: DD19.3 VD10.2
NetDD20_3: DD20.3 VD12.2
NetDD25_4: DD25.4(Q1) DD26.7(1)
NetDD25_6: DD25.6(Q2) DD26.1(2)
NetDD25_8: DD25.8(Q3) DD26.2(4)
NetDD25_10: DD25.10(Q4) DD26.6(8)
NetDD25_15: DD25.15(Q5) DD27.7(1)
NetDD25_17: DD25.17(Q6) DD27.1(2)
NetDD25_19: DD25.19(Q7) DD27.2(4)
NetDD25_21: DD25.21(Q8) DD27.6(8)
NetDD26_9: DD26.9(E) R59.1
NetDD26_10: DD26.10(D) R58.1
NetDD26_11: DD26.11(C) R57.1
NetDD26_12: DD26.12(B) R56.1
NetDD26_13: DD26.13(A) R55.1
NetDD26_14: DD26.14(G) R54.1
NetDD26_15: DD26.15(F) R53.1
NetDD27_9: DD27.9(E) R66.1
NetDD27_10: DD27.10(D) R65.1
NetDD27_11: DD27.11(C) R64.1
NetDD27_12: DD27.12(B) R63.1
NetDD27_13: DD27.13(A) R62.1
NetDD27_14: DD27.14(G) R61.1
NetDD27_15: DD27.15(F) R60.1
NetFU1_1: FU1.1 R52.2 VT5.3(C)
NetFU1_2: FU1.2 S2.3
NetFU2_1: FU2.1 VT5.1(E)
NetHL1_1: HL1.1(A) R33.2
NetHL1_2: HL1.2(B) R34.2
NetHL1_7: HL1.7(C) R35.2
NetHL1_8: HL1.8(D) R36.2
NetHL1_10: HL1.10(E) R37.2
NetHL1_11: HL1.11(F) R31.2
NetHL1_13: HL1.13(G) R32.2
NetHL2_1: HL2.1(A) R40.2
NetHL2_2: HL2.2(B) R41.2
NetHL2_7: HL2.7(C) R42.2
NetHL2_8: HL2.8(D) R43.2
NetHL2_10: HL2.10(E) R44.2
NetHL2_11: HL2.11(F) R38.2
NetHL2_13: HL2.13(G) R39.2
NetHL3_1: HL3.1(A) R55.2
NetHL3_2: HL3.2(B) R56.2
NetHL3_7: HL3.7(C) R57.2
NetHL3_8: HL3.8(D) R58.2
NetHL3_10: HL3.10(E) R59.2
NetHL3_11: HL3.11(F) R53.2
NetHL3_13: HL3.13(G) R54.2
NetHL4_1: HL4.1(A) R62.2
NetHL4_2: HL4.2(B) R63.2
NetHL4_7: HL4.7(C) R64.2
NetHL4_8: HL4.8(D) R65.2
NetHL4_10: HL4.10(E) R66.2
NetHL4_11: HL4.11(F) R60.2
NetHL4_13: HL4.13(G) R61.2
NetR18_1: R18.1 X1.2 X2.2 X3.2 X4.2
NetR45_1: R45.1 VD9.1
NetR46_1: R46.1 VD10.1
NetR47_1: R47.1 VD11.1
NetR48_1: R48.1 VD12.1
NetR49_2: R49.2 R50.1 VT4.2(B)
NetR51_1: R51.1 VT4.3(C)
NetR51_2: R51.2 R52.1 VT5.2(B)

Not connected (* = marked no-connect by the designer): DD9 11(WR) 20(0V) 25(PROG) 26(GND) 33(P16) 34(P17) 40(Ucc); DD10 1 2 3 11 12 13; DD11 5 8; DD12 5 7(GND) 14(Ucc); DD13 12(GND) 23(INR) 24(Ucc); DD14 10(GND) 20(Ucc); DD15 12(GND) 19(Q7) 21(Q8) 23(INR) 24(Ucc); DD16 8(GND) 16(Ucc); DD17 8(GND) 15(Q6) 16(Vcc); DD18 8(GND) 16(Ucc); DD19 8 9 10; DD20 4 5 6 11 12 13; DD21 8(GND) 16(Vcc); DD22 12(GND) 24(Ucc); DD23 7(Y7) 8(GND) 9(Y6) 10(Y5) 11(Y4) 12(Y3) 13(Y2) 14(Y1) 15(Y0) 16(VCC); DD24 7(Y7) 8(GND) 9(Y6) 10(Y5) 11(Y4) 12(Y3) 13(Y2) 14(Y1) 15(Y0) 16(VCC); DD25 12(GND) 23(INR) 24(Ucc); DD26 8(GND) 16(Ucc); DD27 8(GND) 16(Ucc); HL1 3(Ucc) 9(Ucc) 14(Ucc); HL2 3(Ucc) 9(Ucc) 14(Ucc); HL3 3(Ucc) 9(Ucc) 14(Ucc); HL4 3(Ucc) 9(Ucc) 14(Ucc); X1 3; X2 3; X3 3; X4 3

### Buses and harness runs
bus B[1..4]
bus DB[1..8]
bus DC[1..6]
bus XS[1..4]

### Notes on the sheet
- Labels drawn without touching a wire or pin: XS[1..4]
- Перв. примен.
- Справ. №
- Подп. и дата
- Инв. № дубл.
- Взам. инв. №
- Разраб.
- Изм.
- Лист
- № докум.
- Подп.
- Дата
- Лит.
- Масса
- Масштаб
- Пров.
- Т. контр.
- Листов
- Инв. № подл.
- Н. контр.
- Утв.
- Копировал
- Формат А1

### Library data of the parts
C22-C25 = cap_33pF
DD9 = KR1850VE35
DD13 DD15 DD25 = K589IR12
DD14 = KR580BA86
DD17 DD21 = KR1533TM9
DD22 = K556RT7
DD23 DD24 = KR1533ID7
R16-R66 = res_510
S1 = SW-SPST: Single-Pole, Single-Throw Switch; Published: 24-Mar-1999; LatestRevisionDate: 17-Jul-2002; LatestRevisionNote: Re-released for DXP Platform.; PackageReference: SPST-2; Publisher: Altium Limited; PackageDescription: Switch; 2 Leads
S2 = SW-SPDT: SPDT Subminiature Toggle Switch, Right Angle Mounting, Vertical Actuation; Published: 24-Mar-1999; LatestRevisionDate: 17-Dec-2003; LatestRevisionNote: Schematic revised, PCB Footprint replaced.; DatasheetVersion: 05-Dec-2000; PackageReference: TL36WW15050; Publisher: Altium Limited; PackageDescription: Switch; 4 Leads; ComponentLink1Description: Manufacturer Link; ComponentLink1URL: http://www.apem.com
VD5-VD8 = diode_M7
VD9-VD12 = diode_red
VT4 = trans_BC547
ZQ2 = crystal_8mhz

## Nets that join several sheets
Y: main (100 pins), SHEMPEL (57 pins)